# Altium schematic sheet ModuleConnectorA.SchDoc
size A portrait; DocumentNumber: 1; SheetNumber: 1; SheetTotal: 24
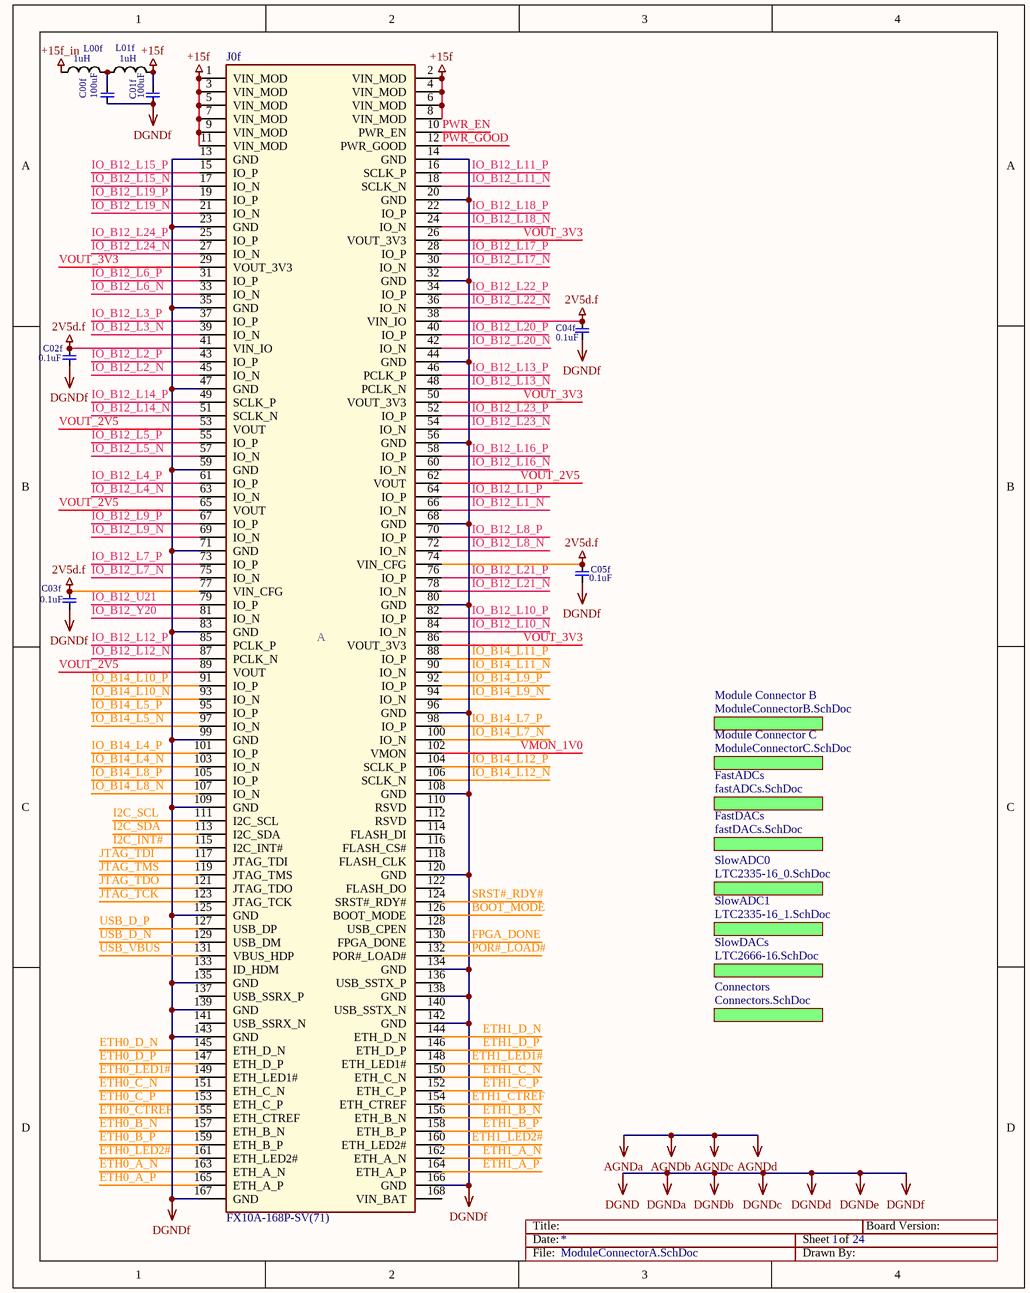
[diagram p0: ModuleConnectorA.SchDoc]

## Parts
C00f  100uF  [1206]
C01f  100uF  [1206]
C02f  0.1uF  [0603]
C03f  0.1uF  [0603]
C04f  0.1uF  [0603]
C05f  0.1uF  [0603]
J0f  FX10A-168P-SV(71)  [Mercury_Baseboard_Connector]
L00f  1uH  [1206]
L01f  1uH  [1206]

## Sub-sheets
Connectors = Connectors.SchDoc: no entries
FastADCs = fastADCs.SchDoc: no entries
FastDACs = fastDACs.SchDoc: no entries
Module Connector B = ModuleConnectorB.SchDoc: no entries
Module Connector C = ModuleConnectorC.SchDoc: no entries
SlowADC0 = LTC2335-16_0.SchDoc: no entries
SlowADC1 = LTC2335-16_1.SchDoc: no entries
SlowDACs = LTC2666-16.SchDoc: no entries

## Nets
2V5d.f: C02f.1 C03f.1 C04f.1 C05f.1 J0f.38(VIN_IO) J0f.41(VIN_IO) J0f.74(VIN_CFG) J0f.77(VIN_CFG)
+15f: C01f.1 J0f.1(VIN_MOD) J0f.2(VIN_MOD) J0f.3(VIN_MOD) J0f.4(VIN_MOD) J0f.5(VIN_MOD) J0f.6(VIN_MOD) J0f.7(VIN_MOD) J0f.8(VIN_MOD) J0f.9(VIN_MOD) J0f.11(VIN_MOD) L01f.2
+15f_in: L00f.1
DGND: C00f.2 C01f.2 C02f.2 C03f.2 C04f.2 C05f.2 J0f.13(GND) J0f.14(GND) J0f.20(GND) J0f.23(GND) J0f.32(GND) J0f.35(GND) J0f.44(GND) J0f.47(GND) J0f.56(GND) J0f.59(GND) J0f.68(GND) J0f.71(GND) J0f.80(GND) J0f.83(GND) J0f.96(GND) J0f.99(GND) J0f.108(GND) J0f.109(GND) J0f.120(GND) J0f.125(GND) J0f.134(GND) J0f.135(GND) J0f.138(GND) J0f.139(GND) J0f.142(GND) J0f.143(GND) J0f.166(GND) J0f.167(GND)  [also labelled DGNDa, DGNDb, DGNDc, DGNDd, DGNDe, DGNDf]
BOOT_MODE: J0f.126(BOOT_MODE)
ETH0_A_N: J0f.163(ETH_A_N)
ETH0_A_P: J0f.165(ETH_A_P)
ETH0_B_N: J0f.157(ETH_B_N)
ETH0_B_P: J0f.159(ETH_B_P)
ETH0_C_N: J0f.151(ETH_C_N)
ETH0_C_P: J0f.153(ETH_C_P)
ETH0_CTREF: J0f.155(ETH_CTREF)
ETH0_D_N: J0f.145(ETH_D_N)
ETH0_D_P: J0f.147(ETH_D_P)
ETH0_LED1#: J0f.149(ETH_LED1#)
ETH0_LED2#: J0f.161(ETH_LED2#)
ETH1_A_N: J0f.162(ETH_A_N)
ETH1_A_P: J0f.164(ETH_A_P)
ETH1_B_N: J0f.156(ETH_B_N)
ETH1_B_P: J0f.158(ETH_B_P)
ETH1_C_N: J0f.150(ETH_C_N)
ETH1_C_P: J0f.152(ETH_C_P)
ETH1_CTREF: J0f.154(ETH_CTREF)
ETH1_D_N: J0f.144(ETH_D_N)
ETH1_D_P: J0f.146(ETH_D_P)
ETH1_LED1#: J0f.148(ETH_LED1#)
ETH1_LED2#: J0f.160(ETH_LED2#)
FPGA_DONE: J0f.130(FPGA_DONE)
I2C_INT#: J0f.115(I2C_INT#)
I2C_SCL: J0f.111(I2C_SCL)
I2C_SDA: J0f.113(I2C_SDA)
IO_B12_L1_N: J0f.66(IO_N)
IO_B12_L1_P: J0f.64(IO_P)
IO_B12_L2_N: J0f.45(IO_N)
IO_B12_L2_P: J0f.43(IO_P)
IO_B12_L3_N: J0f.39(IO_N)
IO_B12_L3_P: J0f.37(IO_P)
IO_B12_L4_N: J0f.63(IO_N)
IO_B12_L4_P: J0f.61(IO_P)
IO_B12_L5_N: J0f.57(IO_N)
IO_B12_L5_P: J0f.55(IO_P)
IO_B12_L6_N: J0f.33(IO_N)
IO_B12_L6_P: J0f.31(IO_P)
IO_B12_L7_N: J0f.75(IO_N)
IO_B12_L7_P: J0f.73(IO_P)
IO_B12_L8_N: J0f.72(IO_N)
IO_B12_L8_P: J0f.70(IO_P)
IO_B12_L9_N: J0f.69(IO_N)
IO_B12_L9_P: J0f.67(IO_P)
IO_B12_L10_N: J0f.84(IO_N)
IO_B12_L10_P: J0f.82(IO_P)
IO_B12_L11_N: J0f.18(SCLK_N)
IO_B12_L11_P: J0f.16(SCLK_P)
IO_B12_L12_N: J0f.87(PCLK_N)
IO_B12_L12_P: J0f.85(PCLK_P)
IO_B12_L13_N: J0f.48(PCLK_N)
IO_B12_L13_P: J0f.46(PCLK_P)
IO_B12_L14_N: J0f.51(SCLK_N)
IO_B12_L14_P: J0f.49(SCLK_P)
IO_B12_L15_N: J0f.17(IO_N)
IO_B12_L15_P: J0f.15(IO_P)
IO_B12_L16_N: J0f.60(IO_N)
IO_B12_L16_P: J0f.58(IO_P)
IO_B12_L17_N: J0f.30(IO_N)
IO_B12_L17_P: J0f.28(IO_P)
IO_B12_L18_N: J0f.24(IO_N)
IO_B12_L18_P: J0f.22(IO_P)
IO_B12_L19_N: J0f.21(IO_N)
IO_B12_L19_P: J0f.19(IO_P)
IO_B12_L20_N: J0f.42(IO_N)
IO_B12_L20_P: J0f.40(IO_P)
IO_B12_L21_N: J0f.78(IO_N)
IO_B12_L21_P: J0f.76(IO_P)
IO_B12_L22_N: J0f.36(IO_N)
IO_B12_L22_P: J0f.34(IO_P)
IO_B12_L23_N: J0f.54(IO_N)
IO_B12_L23_P: J0f.52(IO_P)
IO_B12_L24_N: J0f.27(IO_N)
IO_B12_L24_P: J0f.25(IO_P)
IO_B12_U21: J0f.79(IO_P)
IO_B12_Y20: J0f.81(IO_N)
IO_B14_L4_N: J0f.103(IO_N)
IO_B14_L4_P: J0f.101(IO_P)
IO_B14_L5_N: J0f.97(IO_N)
IO_B14_L5_P: J0f.95(IO_P)
IO_B14_L7_N: J0f.100(IO_N)
IO_B14_L7_P: J0f.98(IO_P)
IO_B14_L8_N: J0f.107(IO_N)
IO_B14_L8_P: J0f.105(IO_P)
IO_B14_L9_N: J0f.94(IO_N)
IO_B14_L9_P: J0f.92(IO_P)
IO_B14_L10_N: J0f.93(IO_N)
IO_B14_L10_P: J0f.91(IO_P)
IO_B14_L11_N: J0f.90(IO_N)
IO_B14_L11_P: J0f.88(IO_P)
IO_B14_L12_N: J0f.106(SCLK_N)
IO_B14_L12_P: J0f.104(SCLK_P)
JTAG_TCK: J0f.123(JTAG_TCK)
JTAG_TDI: J0f.117(JTAG_TDI)
JTAG_TDO: J0f.121(JTAG_TDO)
JTAG_TMS: J0f.119(JTAG_TMS)
POR#_LOAD#: J0f.132(POR#_LOAD#)
PWR_EN: J0f.10(PWR_EN)
PWR_GOOD: J0f.12(PWR_GOOD)
SRST#_RDY#: J0f.124(SRST#_RDY#)
USB_D_N: J0f.129(USB_DM)
USB_D_P: J0f.127(USB_DP)
USB_VBUS: J0f.131(VBUS_HDP)
VMON_1V0: J0f.102(VMON)
VOUT_2V5: J0f.53(VOUT) J0f.62(VOUT) J0f.65(VOUT) J0f.89(VOUT)
VOUT_3V3: J0f.26(VOUT_3V3) J0f.29(VOUT_3V3) J0f.50(VOUT_3V3) J0f.86(VOUT_3V3)
NetC00f_1: C00f.1 L00f.2 L01f.1

Not connected (* = marked no-connect by the designer): J0f 110(RSVD) 112(RSVD) 114(FLASH_DI) 116(FLASH_CS#) 118(FLASH_CLK) 122(FLASH_DO) 128(USB_CPEN) 133(ID_HDM) 136(USB_SSTX_P) 137(USB_SSRX_P) 140(USB_SSTX_N) 141(USB_SSRX_N) 168(VIN_BAT)

## Notes on the sheet
- Title:
- Date:
- Sheet
- of
- Board Version:
- File:
- Drawn By:
- (in symbol Mercury_Baseboard_Connector-A) A

## Library data of the parts
C00f C01f C02f C03f C04f C05f = CAP
J0f = Mercury_Baseboard_Connector-A: Mercury Baseboard Connector; Manufacturer: Hirose; DistPartNumber: FX10A-168P-SV(71)-ND; Board_Variant: ALL; Check Sch: CG_2015-03-03; Enclustra PN: EN100374; Geometry.Height: 4mm stack height; Distributor: Digikey; Package: SMD - 168pin Hirose; ROHS: Yes; Supplier: Enclustra; Characteristics: -; Check PCB: -; Cost: 4.50; ManufPartNumber: FX10A-168P-SV(71); Temperature: -55..+85°C; Type: Connector; Value: FX10A-168P-SV(71)
L00f L01f = INDUCTOR